# Altium schematic sheet Piezoelectric Energy Harvester.SchDoc
size A4; SheetNumber: 1; SheetTotal: 1
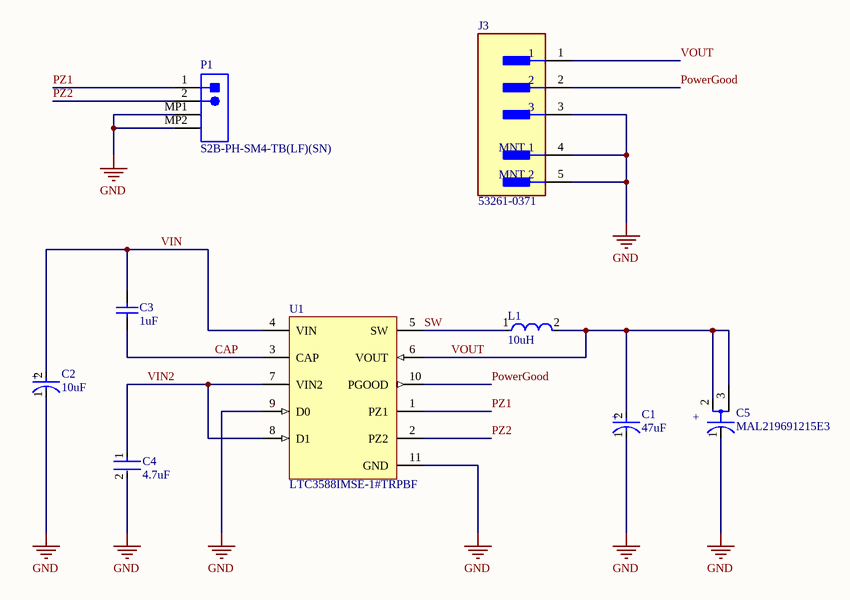
[diagram p0: Piezoelectric Energy Harvester.SchDoc]

## Parts
C1  47uF  [FP-T491D476K025AT-MFG]
C2  10uF  [FP-T491D-MFG]
C3  1uF  [CAPC3216X110X50LL20T25]
C4  4.7uF  [FP-GRM31C-0_2-e0_3_0_8-IPC_B]
C5  MAL219691215E3  [FP-MAL219691215E3-MFG]
J3  53261-0371  [FP-53261-0371-MFG]
L1  10uH  [FP-NR6045-MFG]
P1  S2B-PH-SM4-TB(LF)(SN)  [JST- S2B-PH-SM4-TB(LF)(SN)-2_V]
U1  LTC3588IMSE-1#TRPBF  [LT-MSE-10-EDP_L]

## Nets
GND: C1.1(C) C2.1(C) C4.2 C5.1(C) J3.3 J3.4(MNT_1) J3.5(MNT_2) P1.MP1 P1.MP2 U1.9(D0) U1.11(GND)
CAP: C3.1 U1.3(CAP)
PowerGood: J3.2 U1.10(PGOOD)
PZ1: P1.1 U1.1(PZ1)
PZ2: P1.2 U1.2(PZ2)
SW: L1.1 U1.5(SW)
VIN: C2.2(A) C3.2 U1.4(VIN)
VIN2: C4.1 U1.7(VIN2) U1.8(D1)
VOUT: C1.2(A) C5.2(A) C5.3(A) J3.1 L1.2 U1.6(VOUT)

## Notes on the sheet
- (in symbol CMP-2000-07200-2) +
- (in symbol CMP-02421-000004-1) +
- (in symbol CMP-03017-000020-1) +

## Library data of the parts
C1 = CMP-03017-000020-1: CAP TANT 47UF 10% 25V 2917; Dielectric Material: Tantalum; Life (Hours): 2000Hour; Ripple Current: 463mA; Leakage Current: 11.8uA; Polarity: Polar; ESR (Equivalent Series Resistance): 700mR; Height - Seated (Max): 0.122inch; Package Quantity: 1; Max Operating Temperature: 125°C; Failure Rate: 0.001%; Height: 2.8mm; Voltage Rating (DC): 25V; Dissipation Factor: 10%; Mount: Surface Mount; Min Operating Temperature: -55°C; Packaging: Tape and Reel; Radiation Hardening: No; Case Code (Metric): 7343; Features: General Purpose; Voltage: 25V; Case/Package: 2917; Capacitance: 47uF; Case Code (Imperial): 2917; Tolerance: 10%; Number of Pins: 2; Weight: 0.023634oz; REACH SVHC: No SVHC; RoHS Compliant: Yes; Length: 7.3mm; Depth: 4.3mm; Lead Free: Lead Free; Width: 4.3mm; Voltage Rating: 25V; Termination: SMD/SMT
C2 = CMP-2000-07200-2: CAP TANT 10UF 10% 25V 2917; Tolerance: 20%; Life (Hours): 2000Hour; Dielectric Material: Tantalum; Dissipation Factor: 6%; Leakage Current: 2.5uA; Ripple Current: 387mA; Polarity: Polar; ESR (Equivalent Series Resistance): 1R; Voltage: 25V; Capacitance: 10uF; Voltage Rating: 25V; Voltage Rating (DC): 25V; Depth: 4.3mm; Mount: Surface Mount; Length: 7.3mm; Termination: SMD/SMT; Radiation Hardening: No; Max Operating Temperature: 125°C; REACH SVHC: No SVHC; Height: 2.8mm; Package Quantity: 1; Packaging: Tape and Reel; Case Code (Imperial): 2917; Width: 4.3mm; Min Operating Temperature: -55°C; Features: General Purpose; Case Code (Metric): 7343; Height - Seated (Max): 0.122inch; Number of Pins: 2; Lead Free: Lead Free; Case/Package: 2917
C3 = CMP-2000-06011-1: Chip Capacitor, 1 uF, +/- 10%, 50 V, -55 to 125 degC, 1206 (3216 Metric), RoHS, Tape and Reel; Manufacturer: Kemet; Case Height: 1mm; Dielectric: X7R; Voltage Rating: 50V; Temperature Coefficient / Code: +/-15%; Case Length: 3.2mm; Case Width: 1.6mm; Type: SMDMLCCX7R6.3-250VDCCommericalGrade; Class: Class1; Capacitance - nF: 1000nF; Datasheet URL: http://www.kemet.com/docfinder?Partnumber=C1206C105K5RACTU; Product Category: MultilayerCeramicCapacitorsMLCC-SMD/SMT; Capacitance: 1uF; Termination Style: SMD/SMT; Dimensions: 1.6mmWx3.2mmLx1mmH; Voltage Rating DC: 50V; Datasheet Version: 02/2016; Packaging: Reel; Brand: Kemet; RoHS: Details; Minimum Operating Temperature: -55C; Operating Temperature Range: -55Cto+125C; Package Reference: 1206; Manufacturer URL: http://www.kemet.com/; Product: GeneralTypeMLCCs; Tolerance: 10%; Package Description: 2-Pin Surface Mount Device, Body 3.2 x 1.6 mm; Mounting Technology: SurfaceMount; Case Code - mm: 3216; Maximum Operating Temperature: +125C; Series: C1206C; Factory Pack Quantity: 2500; Package / Case: 1206(3216metric); Case Code - in: 1206
C4 = CMP-1037-04923-3: Chip Multilayer Ceramic Capacitors for General Purpose, 1206, 4.7uF, X7R, 15%, 10%, 50V; Height: 1.6mm; Voltage: 50V; Capacitance: 4.7uF; Lead Free: Lead Free; Max Operating Temperature: 125°C; Packaging: Tape and Reel; REACH SVHC: No SVHC; Voltage Rating: 50V; Mount: Surface Mount; Termination: SMD/SMT; Tolerance: 10%; Case/Package: 1206; Material: Ceramic; Depth: 1.6mm; Length: 3.2mm; Case Code (Metric): 3216; Voltage Rating (DC): 50V; Case Code (Imperial): 1206; Radiation Hardening: No; Width: 0.063inch; Thickness: 0.071inch; Package Quantity: 2000; Min Operating Temperature: -55°C; Dielectric: X7R
C5 = CMP-02421-000004-1: CAP 15F -20% +80% 7V T/H; Leakage Current: 120uA; Tolerance: 80%; ESR (Equivalent Series Resistance): 12.5R; Life (Hours): 1000Hour; Lead Diameter: 0.64mm; Package Quantity: 40; Length: 0.492inch; Max Operating Temperature: 85°C; Lead Pitch: 0.512inch; Voltage: 7V; Termination: Through Hole; Voltage Rating (DC): 7V; Orientation: Horizontal; Packaging: Tray; Min Operating Temperature: -20°C; RoHS Compliant: Yes; Diameter: 12mm; Capacitance: 15F; Series: 196 HVC; Case/Package: B; Voltage Rating: 7V; Height: 12.5mm; Mount: Through Hole
J3 = CMP-04776-000071-1: CONN HEADER SMD R/A 3POS 1.25MM; Manufacturer: Molex; Number Of Contacts: 3; Conn Orientation: Right Angle; Current Rating: 1A; Description: Wire-To-Board Connector, Right Angle, 1.25 mm, 3 Contacts, Header, PicoBlade 53261 Series; Voltage Rating: 125V; Conn Gender: Male; Category: Conn; Automotive: No; Footprint Url: https://www.molex.com/pdm_docs/sd/532610371_sd.pdf; Height: 3.6mm; Number Of Rows: 1; Temperature Range Low: -40°C; Package: 0; Octopart: https://octopart.com/53261-0371-molex-655314; ComponentLink2Description: Datasheet; Lead Free: Yes; Ambient Temperature Range Low: -40°C; Device Class L3: unset; Mouser Description: 1.25mm (.049") Pitch PicoBlade Header, Surface Mount, Right Angle, Lead-free, 3 Circuits; Digikey Description: CONN HEADER SMD R/A 3POS 1.25MM; Device Class L2: Headers and Wire Housings; Contact Material: Tin,Nickel; Manufacturer Part Number: 53261-0371; Ambient Temperature Range High: +105°C; ComponentLink2URL: https://www.molex.com/webdocs/datasheets/pdf/en-us/0532610371_PCB_HEADERS.pdf; Pitch: 1.25mm; Temperature: -40°C to +105°C; RoHS: TRUE; Device Class L1: Connectors; Temperature Range High: +105°C
L1 = CMP-14484-001000-1: Shielded Wirewound Inductor 10uH 20% 2.5A 61.1mΩ SMD; Test Frequency: 100kHz; Self Resonant Frequency: 12MHz; DC Resistance (DCR): 61.1mR; Saturation Current: 3A; Core Material: Ferrite; RMS Current (Irms): 2.5A; Packaging: Tape and Reel; Resistor Type: Wirewound; Height: 4.5mm; Inductance: 10uH; Max DC Current: 2.5A; Width: 6mm; Mount: Surface Mount; Height - Seated (Max): 0.177inch; Termination: SMD/SMT; Halogen Free: Halogen Free; Min Operating Temperature: -25°C; Max Operating Temperature: 120°C; RoHS Compliant: Yes; Tolerance: 20%; Case/Package: 2424; Series: NR; Number of Pins: 2; Inductance Tolerance: 20%; Length: 0.236inch; Current Rating: 2.5A; Package Quantity: 1500; Shielding: Shielded
P1 = CMP-1755-00001-1: Male Header, Pitch 2 mm, 1 x 2 Position, Height 5.5 mm, -25 to 85 degC, RoHS, Tape and Reel; Current Rating: 3 A; ComponentLink1URL: http://www.jst.com/home2.html; Radiation Hardening: No; RoHSCompliant: True; Mount: Through Hole; Contact Material: Bronze; Package Quantity: 100; Width: 2.34 mm; DatasheetVersion: Dec-12; Height: 8.13 mm; Max Operating Temperature: 105degC; ComponentLink2Description: Datasheet; Lead Pitch: 0.1 inch; Contact Finish: Lead; Packaging: Bulk; Colour: Black; Contact Plating: Tin; Min Operating Temperature: -65degC; ComponentLink1Description: Manufacturer URL; PackageReference: S2B-PH-SM4-TB(LF)(SN)-2; PackageDescription: Male Header, Pitch 2 mm, 1 x 2 Position, Height 5.5 mm; ComponentLink2URL: http://www.jst-mfg.com/product/pdf/eng/ePH.pdf; Pins: 40; Length: 101.19 mm
U1 = CMP-0473-00114-1: Piezoelectric Energy Harvesting Power Supply, 10-pin SOP (MSE-10), -40 to 125 degC, Pb-Free, Tape and Reel; Manufacturer: Linear Technology; Vin Max(V): 20; Vout Max(V): 1.8, 2.5, 3.3, 3.6; Number of Outputs: 1; Vin Min(V): 2.7; Topology: Buck; ComponentLink3Description: Package Specification; PartNumber: LTC3588IMSE-1#TRPBF; ComponentLink3URL: http://cds.linear.com/docs/en/packaging/05081664_I_MSE.pdf; PackageDescription: 10-Pin Plastic MSOP, Exposed Die Pad, Body 3 x 3 mm, Pitch 0.5 mm; ComponentLink1Description: Manufacturer URL; DatasheetVersion: Rev. A; Packing: Tape and Reel; PackageVersion: Rev. I, 05/2013; Mounting Technology: Surface Mount; ComponentLink2Description: Datasheet; Energy Source: Piezoelectric; ComponentLink1URL: http://www.linear.com/; ComponentLink2URL: http://cds.linear.com/docs/en/datasheet/35881fa.pdf; PackageReference: MSE-10; RoHS: TRUE